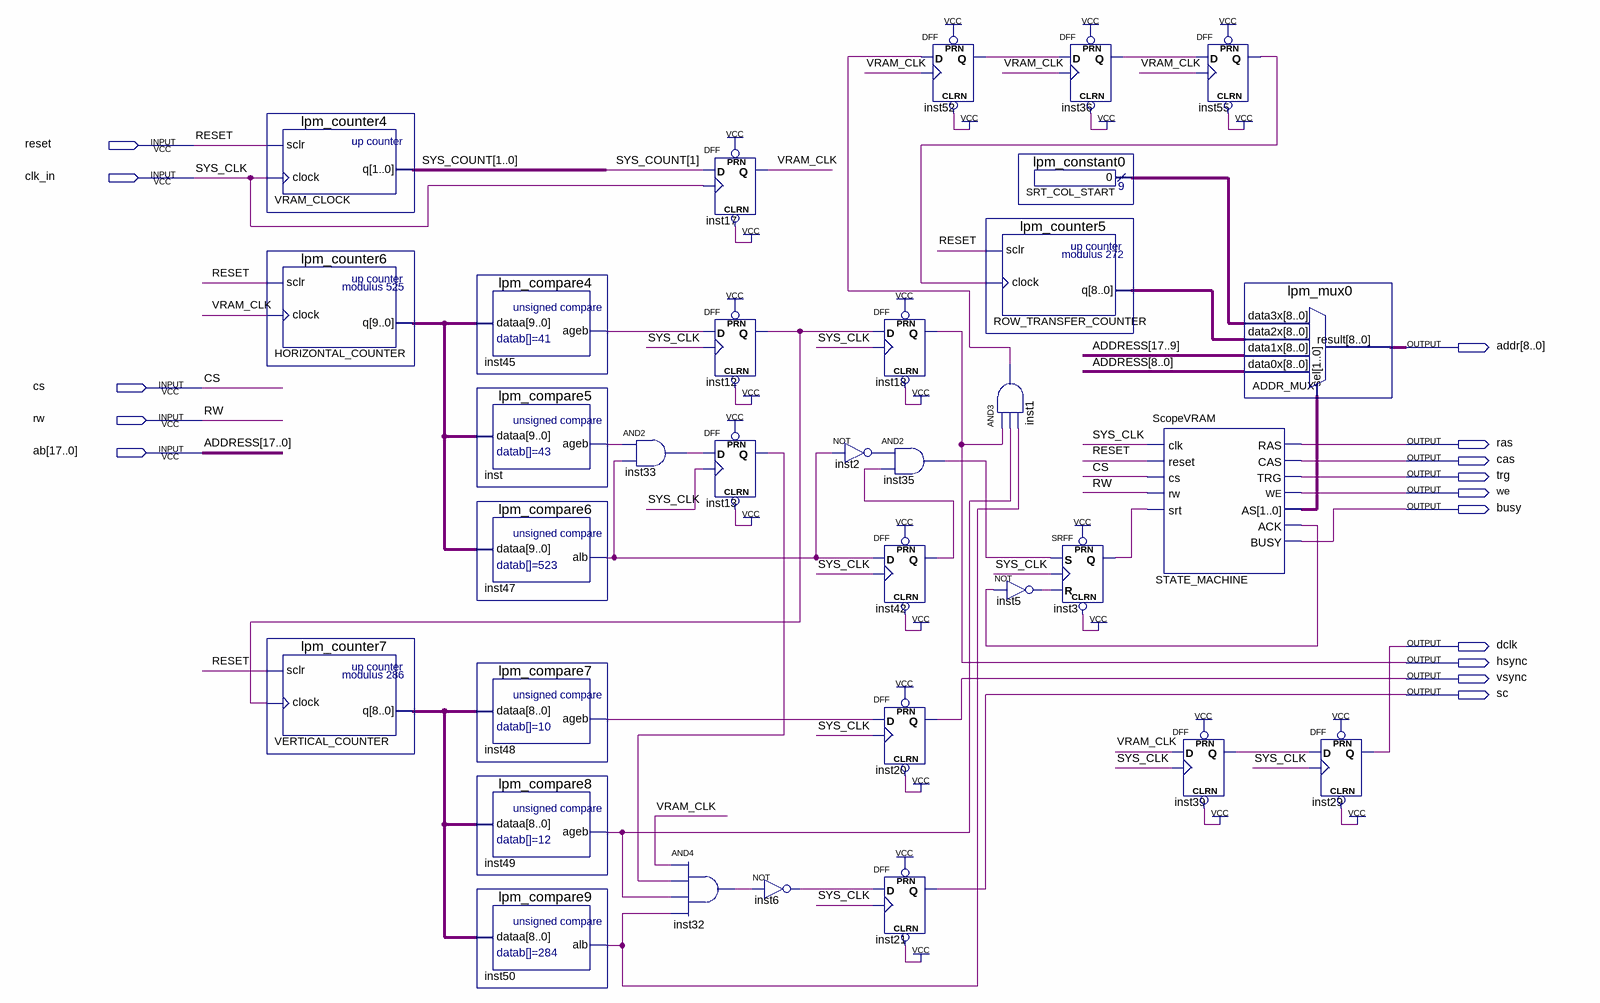
[diagram p0: schematic sheet]
// Quartus schematic vramctrl.bdf as structural Verilog: 33 symbols, 15 pins
module vramctrl (
  input  reset,
  input  clk_in,
  input  cs,
  input  rw,
  input  [17:0] ab,
  output [8:0] addr,
  output ras,
  output cas,
  output trg,
  output we,
  output busy,
  output dclk,
  output hsync,
  output vsync,
  output sc
);

  wire inst1_out, inst2_out, inst3_q, inst5_out, inst6_out, inst12_q, inst13_q, inst32_out, inst33_out,
       inst35_out, inst36_q, inst39_q, inst42_q, inst45_ageb, inst47_alb, inst48_ageb, inst49_ageb,
       inst50_alb, inst52_q, inst55_q, inst_ageb, STATE_MACHINE_ack, VRAM_CLK;
  wire [1:0] STATE_MACHINE_as, SYS_COUNT;
  wire [8:0] ROW_TRANSFER_COUNTER_q, SRT_COL_START_result, VERTICAL_COUNTER_q;
  wire [9:0] HORIZONTAL_COUNTER_q;

  lpm_counter4 VRAM_CLOCK (.sclr(reset), .clock(clk_in), .q(SYS_COUNT));
  lpm_counter6 HORIZONTAL_COUNTER (.sclr(reset), .clock(VRAM_CLK), .q(HORIZONTAL_COUNTER_q));
  lpm_counter7 VERTICAL_COUNTER (.sclr(reset), .clock(inst12_q), .q(VERTICAL_COUNTER_q));
  lpm_compare4 inst45 (.dataa(HORIZONTAL_COUNTER_q), .ageb(inst45_ageb));
  lpm_compare5 inst (.dataa(HORIZONTAL_COUNTER_q), .ageb(inst_ageb));
  lpm_compare6 inst47 (.dataa(HORIZONTAL_COUNTER_q), .alb(inst47_alb));
  lpm_compare7 inst48 (.dataa(VERTICAL_COUNTER_q), .ageb(inst48_ageb));
  lpm_compare8 inst49 (.dataa(VERTICAL_COUNTER_q), .ageb(inst49_ageb));
  lpm_compare9 inst50 (.dataa(VERTICAL_COUNTER_q), .alb(inst50_alb));
  and inst33 (inst33_out, inst_ageb, inst47_alb);
  and inst32 (inst32_out, VRAM_CLK, inst13_q, inst49_ageb, inst50_alb);
  DFF inst17 (.CLRN(1'b1), .CLK(clk_in), .D(SYS_COUNT[1]), .PRN(1'b1), .Q(VRAM_CLK));
  DFF inst12 (.CLRN(1'b1), .CLK(clk_in), .D(inst45_ageb), .PRN(1'b1), .Q(inst12_q));
  DFF inst13 (.CLRN(1'b1), .CLK(clk_in), .D(inst33_out), .PRN(1'b1), .Q(inst13_q));
  not inst6 (inst6_out, inst32_out);
  not inst2 (inst2_out, inst47_alb);
  DFF inst52 (.CLRN(1'b1), .CLK(VRAM_CLK), .D(inst1_out), .PRN(1'b1), .Q(inst52_q));
  DFF inst18 (.CLRN(1'b1), .CLK(clk_in), .D(inst12_q), .PRN(1'b1), .Q(hsync));
  and inst35 (inst35_out, inst2_out, inst42_q);
  DFF inst42 (.CLRN(1'b1), .CLK(clk_in), .D(inst47_alb), .PRN(1'b1), .Q(inst42_q));
  DFF inst20 (.CLRN(1'b1), .CLK(clk_in), .D(inst48_ageb), .PRN(1'b1), .Q(vsync));
  DFF inst21 (.CLRN(1'b1), .CLK(clk_in), .D(inst6_out), .PRN(1'b1), .Q(sc));
  lpm_counter5 ROW_TRANSFER_COUNTER (.sclr(reset), .clock(inst55_q), .q(ROW_TRANSFER_COUNTER_q));
  and inst1 (inst1_out, hsync, inst49_ageb, inst50_alb);
  not inst5 (inst5_out, STATE_MACHINE_ack);
  DFF inst36 (.CLRN(1'b1), .CLK(VRAM_CLK), .D(inst52_q), .PRN(1'b1), .Q(inst36_q));
  lpm_constant0 SRT_COL_START (.result(SRT_COL_START_result));
  SRFF inst3 (.PRN(1'b1), .CLRN(1'b1), .S(inst35_out), .R(inst5_out), .CLK(clk_in), .Q(inst3_q));
  ScopeVRAM STATE_MACHINE (
    .clk(clk_in), .reset(reset), .cs(cs), .rw(rw), .srt(inst3_q), .RAS(ras), .CAS(cas), .TRG(trg), .WE(we),
    .AS(STATE_MACHINE_as), .ACK(STATE_MACHINE_ack), .BUSY(busy));
  DFF inst39 (.CLRN(1'b1), .CLK(clk_in), .D(VRAM_CLK), .PRN(1'b1), .Q(inst39_q));
  DFF inst55 (.CLRN(1'b1), .CLK(VRAM_CLK), .D(inst36_q), .PRN(1'b1), .Q(inst55_q));
  lpm_mux0 ADDR_MUX (
    .data3x(SRT_COL_START_result), .data2x(ROW_TRANSFER_COUNTER_q), .data1x(ab[17:9]), .data0x(ab[8:0]),
    .sel(STATE_MACHINE_as), .result(addr));
  DFF inst29 (.CLRN(1'b1), .CLK(clk_in), .D(inst39_q), .PRN(1'b1), .Q(dclk));

  // Other names for the same wires on the sheet: ADDRESS[17:0] = ab; SYS_CLK = clk_in
endmodule
